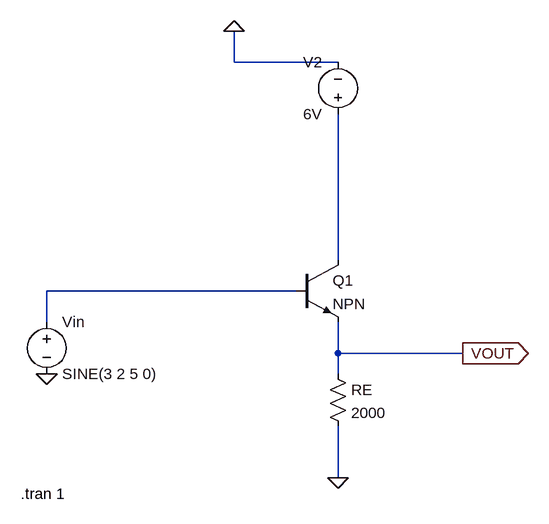
[diagram p0: schematic Emitter Follower.asc]
Emitter Follower.asc, the LTspice schematic file:
Version 4.1
SHEET 1 940 680
WIRE 464 -304 464 -352
WIRE 624 -304 464 -304
WIRE 624 0 624 -224
WIRE 560 48 176 48
WIRE 176 96 176 48
WIRE 624 144 624 96
WIRE 816 144 624 144
WIRE 624 176 624 144
WIRE 624 336 624 256
FLAG 176 176 0
FLAG 464 -352 0
FLAG 624 336 0
FLAG 816 144 VOUT
IOPIN 816 144 Out
SYMBOL voltage 176 80 R0
WINDOW 123 0 0 Left 0
WINDOW 39 0 0 Left 0
SYMATTR InstName Vin
SYMATTR Value SINE(3 2 5 0)
SYMBOL npn 560 0 R0
SYMATTR InstName Q1
SYMBOL voltage 624 -208 R180
WINDOW 0 24 96 Left 2
WINDOW 3 24 16 Left 2
WINDOW 123 0 0 Left 0
WINDOW 39 0 0 Left 0
SYMATTR InstName V2
SYMATTR Value 6V
SYMBOL res 608 160 R0
SYMATTR InstName RE
SYMATTR Value 2000
TEXT 136 360 Left 2 !.tran 1

The netlist it stands for:
* Emitter Follower.asc
Vin N002 0 SINE(3 2 5 0)
Q1 N001 N002 VOUT 0 NPN
V2 N001 0 6V
RE VOUT 0 2000
.model NPN NPN
.model PNP PNP
.lib standard.bjt
.tran 1
.backanno
.end